# EAGLE design daisy (EAGLE 7.6.0)
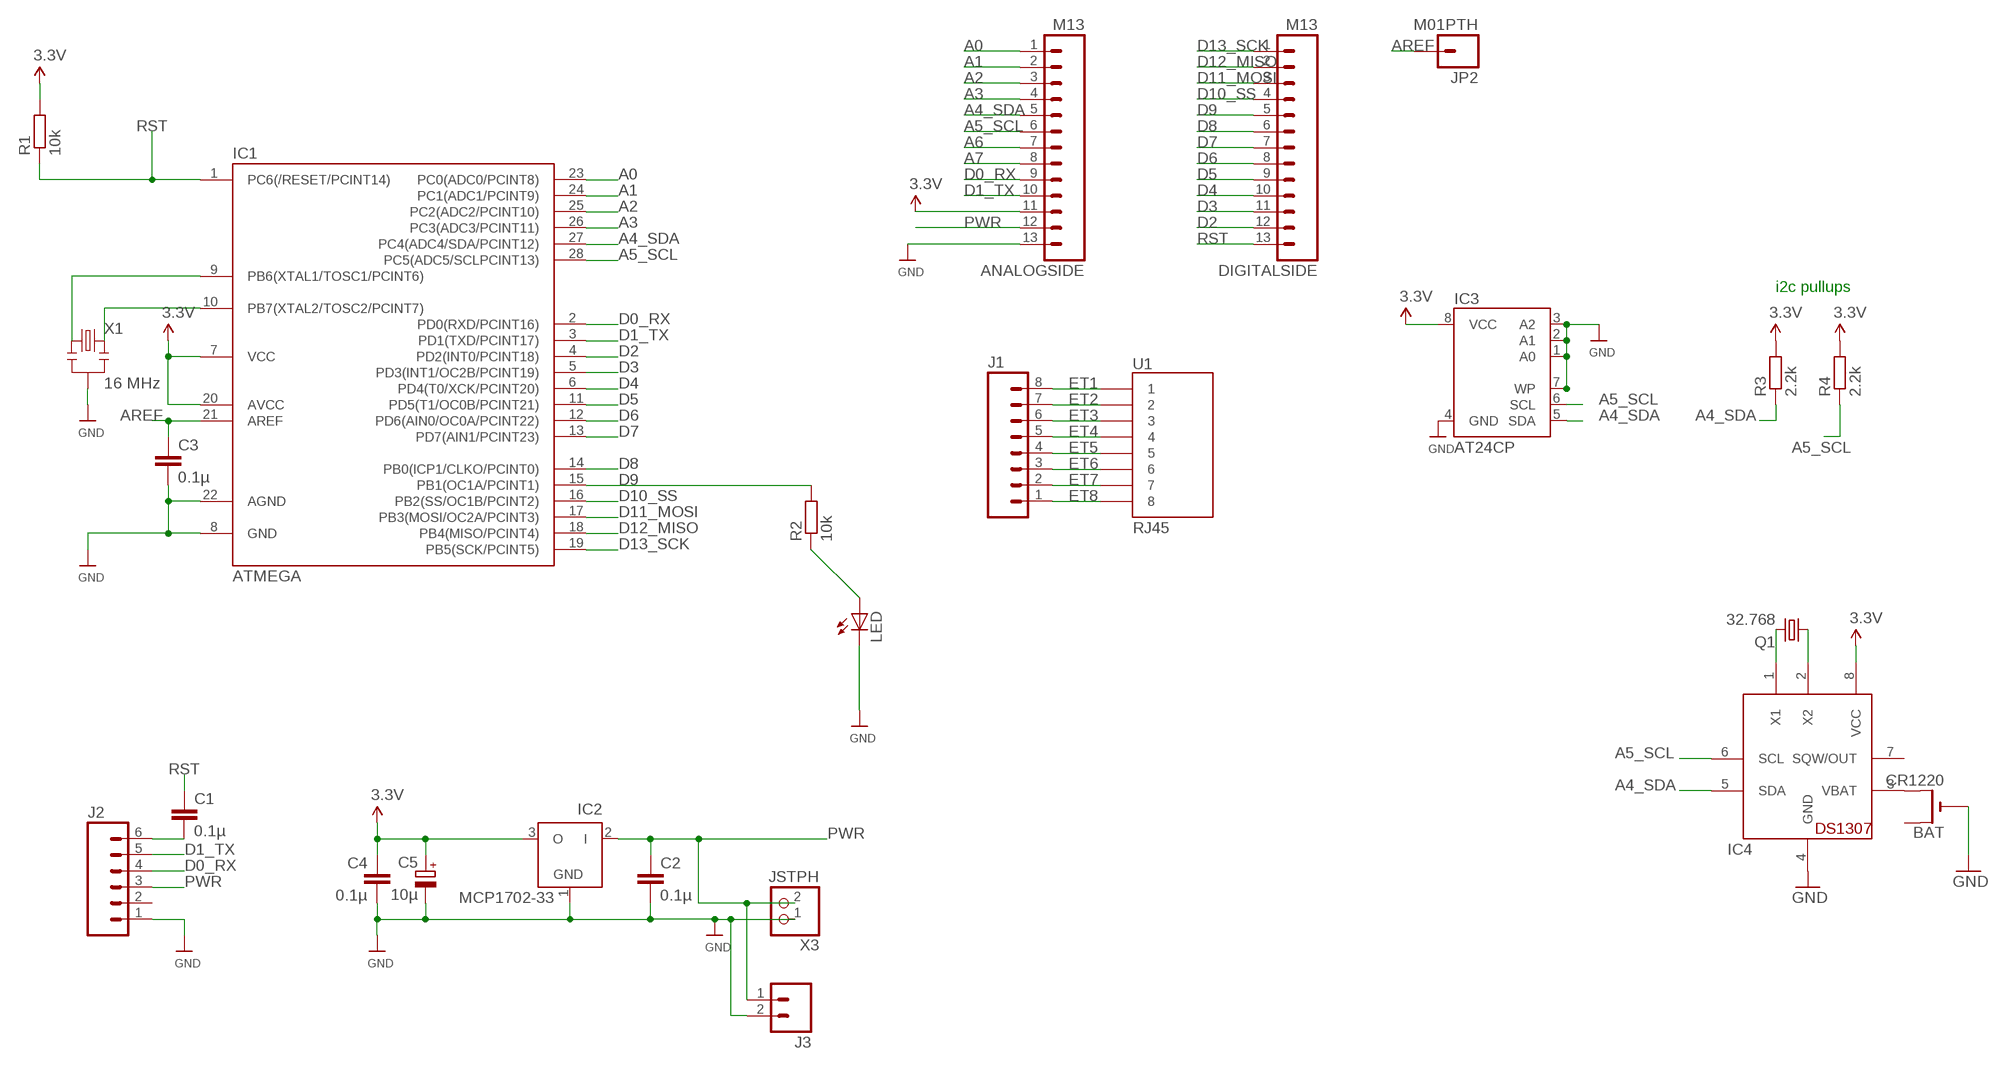
[diagram p0: schematic, sheet 1]

## Parts
ANALOGSIDE  M13  [1X13]
BAT  CR1220  CR1220THM  [CR1220-THM]
C1  0.1µ  C-EU025-024X044  [C025-024X044]
C2  0.1µ  C-EU025-024X044  [C025-024X044]
C3  0.1µ  C-EU025-024X044  [C025-024X044]
C4  0.1µ  C-EU025-024X044  [C025-024X044]
C5  10µ  CPOL-EUE1.8-4  [E1,8-4]
DIGITALSIDE  M13  [1X13]
IC1  ATMEGA  ATMEGA48/88/168-PU  [DIL28-3]
IC2  MCP1702-33  MCP1702Z  [TO92]
IC3  AT24CP  [DIL08]
IC4  DS1307  [DIL08]
J1  M08  [1X08_ROUND]
J2  M06SILK_FEMALE_PTH  [1X06]
J3  M02PTH  [1X02]
JP2  M01PTH  [1X01]
LED  LED3MM  [LED3MM]
Q1  32.768  CRYTALTC38H  [TC38H]
R1  10k  R-EU_0204/7  [0204/7]
R2  10k  R-EU_0204/7  [0204/7]
R3  2.2k  R-EU_0204/7  [0204/7]
R4  2.2k  R-EU_0204/7  [0204/7]
U1  RJ45  RJ45-8PTH  [RJ45-8]
X1  16 MHz  RESONATORPTH  [RESONATOR-PTH]
X3  JSTPH  CON_JST_PH_2PIN  [JSTPH2]

## Nets
A0: ANALOGSIDE.1 IC1.23(PC0(ADC0/PCINT8))
A1: ANALOGSIDE.2 IC1.24(PC1(ADC1/PCINT9))
A2: ANALOGSIDE.3 IC1.25(PC2(ADC2/PCINT10))
A3: ANALOGSIDE.4 IC1.26(PC3(ADC3/PCINT11))
A4_SDA: ANALOGSIDE.5 IC1.27(PC4(ADC4/SDA/PCINT12)) IC3.5(SDA) IC4.5(SDA) R3.1
A5_SCL: ANALOGSIDE.6 IC1.28(PC5(ADC5/SCLPCINT13)) IC3.6(SCL) IC4.6(SCL) R4.1
A6: ANALOGSIDE.7
A7: ANALOGSIDE.8
AREF: C3.1 IC1.21(AREF) JP2.1
D0_RX: ANALOGSIDE.9 IC1.2(PD0(RXD/PCINT16)) J2.4
D1_TX: ANALOGSIDE.10 IC1.3(PD1(TXD/PCINT17)) J2.5
D2: DIGITALSIDE.12 IC1.4(PD2(INT0/PCINT18))
D3: DIGITALSIDE.11 IC1.5(PD3(INT1/OC2B/PCINT19))
D4: DIGITALSIDE.10 IC1.6(PD4(T0/XCK/PCINT20))
D5: DIGITALSIDE.9 IC1.11(PD5(T1/OC0B/PCINT21))
D6: DIGITALSIDE.8 IC1.12(PD6(AIN0/OC0A/PCINT22))
D7: DIGITALSIDE.7 IC1.13(PD7(AIN1/PCINT23))
D8: DIGITALSIDE.6 IC1.14(PB0(ICP1/CLKO/PCINT0))
D9: DIGITALSIDE.5 IC1.15(PB1(OC1A/PCINT1)) R2.2
D10_SS: DIGITALSIDE.4 IC1.16(PB2(SS/OC1B/PCINT2))
D11_MOSI: DIGITALSIDE.3 IC1.17(PB3(MOSI/OC2A/PCINT3))
D12_MISO: DIGITALSIDE.2 IC1.18(PB4(MISO/PCINT4))
D13_SCK: DIGITALSIDE.1 IC1.19(PB5(SCK/PCINT5))
ET1: J1.8 U1.1
ET2: J1.7 U1.2
ET3: J1.6 U1.3
ET4: J1.5 U1.4
ET5: J1.4 U1.5
ET6: J1.3 U1.6
ET7: J1.2 U1.7
ET8: J1.1 U1.8
GND [power]: ANALOGSIDE.13 BAT.- C2.2 C3.2 C4.2 C5.- IC1.8(GND) IC1.22(AGND) IC2.1(GND) IC3.1(A0) IC3.2(A1) IC3.3(A2) IC3.4(GND) IC3.7(WP) IC4.4(GND) J2.1 J3.2 LED.K(C) X1.2 X3.1
N$1: IC1.9(PB6(XTAL1/TOSC1/PCINT6)) X1.1
N$2: LED.A R2.1
N$14: IC4.1(X1) Q1.2
N$15: IC4.2(X2) Q1.1
N$20: C1.2 J2.6
N$21: IC1.10(PB7(XTAL2/TOSC2/PCINT7)) X1.3
N$39: BAT.+2(+1) IC4.3(VBAT)
PWR [power]: ANALOGSIDE.12 C2.1 IC2.2(I) J2.3 J3.1 X3.2
RST: C1.1 DIGITALSIDE.13 IC1.1(PC6(/RESET/PCINT14)) R1.1
VCC [power]: ANALOGSIDE.11 C4.1 C5.+ IC1.7(VCC) IC1.20(AVCC) IC2.3(O) IC3.8(VCC) IC4.8(VCC) R1.2 R3.2 R4.2 ; supply symbol labelled 3.3V
Unconnected: BAT.+1(+) IC4.7(SQW/OUT) J2.2

## Notes on the sheet
- i2c pullups

## Library data of the parts
ANALOGSIDE DIGITALSIDE = SparkFun-Connectors:M13: 13-pin single row .1" header
BAT = adafruit:CR1220: CR1216/CR1220/CR1225 12mm 3V lithium coin cell Great for battery packup. Both SMT and THM holders. Note the THM package has the ground pads on both sides of the PCB so that the masks are the same - this reduces the cost
C1-C4 = resistor:C-EU: CAPACITOR, European symbol
C5 = resistor:CPOL-EU: POLARIZED CAPACITOR, European symbol
IC1 = atmega8:ATMEGA48/88/168-PU
IC2 = JeeLabs:MCP1702: 200 mA, Low Power Low Dropout Voltage Regulator
IC3 = atmel:AT24C*: 2-wire serial EEPROM; MPN: AT24C1024BW-SH-B; OC_FARNELL: 1362646; OC_NEWARK: 03P2044
IC4 = adafruit:DS1307: DS1307 Real time clock (RTC) with battery backup ability. Talk to it via i2c
J1 = SparkFun-Connectors:M08: Header 8 Standard 8-pin 0.1" header. Use with straight break away headers (SKU : PRT-00116), right angle break away headers (PRT-00553), swiss pins (PRT-00743), machine pins (PRT-00117), and female headers (PRT-00115).; PROD_ID: CONN-08437
J2 = SparkFun-Connectors:M06: Header 6 Standard 6-pin 0.1" header. Use with straight break away headers (SKU : PRT-00116), right angle break away headers (PRT-00553), swiss pins (PRT-00743), machine pins (PRT-00117), and female headers (PRT-00115). Molex polarized connector foot print use with SKU : PRT-08094 with associated crimp pins and housings. NOTES ON THE VARIANTS LOCK and LOCK_LONGPADS... This footprint was designed to help hold the alignment of a through-hole component (i.e. 6-pin header) while soldering it into place. You may notice that each hole has been shifted either up or down by 0.005 of an inch from it's more standard position (which is a perfectly straight line). This slight alteration caused the pins (the squares in the middle) to touch the edges of the holes. Because they are alternating, it causes a "brace" to hold the component in place. 0.005 has proven to be the perfect amount of "off-center" position when using our standard breakaway headers. Although looks a little odd when you look at the bare footprint, once you have a header in there, the alteration is very hard to notice. Also,if you push a header all the way into place, it is covered up entirely on the bottom side. This idea of altering the position of holes to aid alignment will be further integrated into the Sparkfun Library for other footprints. It can help hold any component with 3 or more connection pins.; PROD_ID: CONN-08437
J3 = SparkFun-Connectors:M02: Standard 2-pin 0.1" header. Use with - straight break away headers ( PRT-00116) - right angle break away headers (PRT-00553) - swiss pins (PRT-00743) - machine pins (PRT-00117) - female headers (PRT-00115) Molex polarized connector foot print use with: PRT-08233 with associated crimp pins and housings. 2.54_SCREWTERM for use with PRT-10571. 3.5mm Screw Terminal footprints for PRT-08084 5mm Screw Terminal footprints for use with PRT-08432
JP2 = SparkFun-Connectors:M01: Header 1 Standard 1-pin 0.1" header. Use with straight break away headers (SKU : PRT-00116), right angle break away headers (PRT-00553), swiss pins (PRT-00743), machine pins (PRT-00117), and female headers (PRT-00115).
LED = led:LED: LED OSRAM: - CHIPLED LG R971, LG N971, LY N971, LG Q971, LY Q971, LO R971, LY R971 LH N974, LH R974 LS Q976, LO Q976, LY Q976 LO Q996 - Hyper CHIPLED LW Q18S LB Q993, LB Q99A, LB R99A - SideLED LS A670, LO A670, LY A670, LG A670, LP A670 LB A673, LV A673, LT A673, LW A673 LH A674 LY A675 LS A676, LA A676, LO A676, LY A676, LW A676 LS A679, LY A679, LG A679 - Hyper Micro SIDELED® LS Y876, LA Y876, LO Y876, LY Y876 LT Y87S - SmartLED LW L88C, LW L88S LB L89C, LB L89S, LG L890 LS L89K, LO L89K, LY L89K LS L896, LA L896, LO L896, LY L896 - TOPLED LS T670, LO T670, LY T670, LG T670, LP T670 LSG T670, LSP T670, LSY T670, LOP T670, LYG T670 LG T671, LOG T671, LSG T671 LB T673, LV T673, LT T673, LW T673 LH T674 LS T676, LA T676, LO T676, LY T676, LB T676, LH T676, LSB T676, LW T676 LB T67C, LV T67C, LT T67C, LS T67K, LO T67K, LY T67K, LW E67C LS E67B, LA E67B, LO E67B, LY E67B, LB E67C, LV E67C, LT E67C LW T67C LS T679, LY T679, LG T679 LS T770, LO T770, LY T770, LG T770, LP T770 LB T773, LV T773, LT T773, LW T773 LH T774 LS E675, LA E675, LY E675, LS T675 LS T776, LA T776, LO T776, LY T776, LB T776 LHGB T686 LT T68C, LB T68C - Hyper Mini TOPLED® LB M676 - Mini TOPLED Santana® LG M470 LS M47K, LO M47K, LY M47K Source: http://www.osram.convergy.de LUXEON: - LUMILED® LXK2-PW12-R00, LXK2-PW12-S00, LXK2-PW14-U00, LXK2-PW14-V00 LXK2-PM12-R00, LXK2-PM12-S00, LXK2-PM14-U00 LXK2-PE12-Q00, LXK2-PE12-R00, LXK2-PE12-S00, LXK2-PE14-T00, LXK2-PE14-U00 LXK2-PB12-K00, LXK2-PB12-L00, LXK2-PB12-M00, LXK2-PB14-N00, LXK2-PB14-P00, LXK2-PB14-Q00 LXK2-PR12-L00, LXK2-PR12-M00, LXK2-PR14-Q00, LXK2-PR14-R00 LXK2-PD12-Q00, LXK2-PD12-R00, LXK2-PD12-S00 LXK2-PH12-R00, LXK2-PH12-S00 LXK2-PL12-P00, LXK2-PL12-Q00, LXK2-PL12-R00 Source: www.luxeon.com KINGBRIGHT: KA-3528ASYC Source: www.kingbright.com
Q1 = crystal:CRYTAL: CRYSTAL
R1-R4 = resistor:R-EU_: RESISTOR, European symbol
U1 = SparkFun:RJ45-8: RJ45 Jack Simple RJ45, 8-pin connection - connector for common Cat5, Cat5e, and Cat6 Ethernet cables. Footprint not yet proven in production. Connector sku is PRT-00643; Breakout PCB sku is BOB-00716.
X1 = SparkFun:RESONATOR: Resonator Small SMD resonator. This is the itty bitty 10/20MHz resonators with built in caps. CSTCE10M0G55 and CSTCE20M0V53. Footprint has been reviewed closely but hasn't been tested yet.
X3 = microbuilder:CON_JST_PH_2PIN: JST 2-Pin Right-Angle Connector PH-Series - 4UConnector: 17311 SH-Series - 4UConnector: 07278

## Net classes
1 power: width 0.381 mm, clearance 0.254 mm

## Board
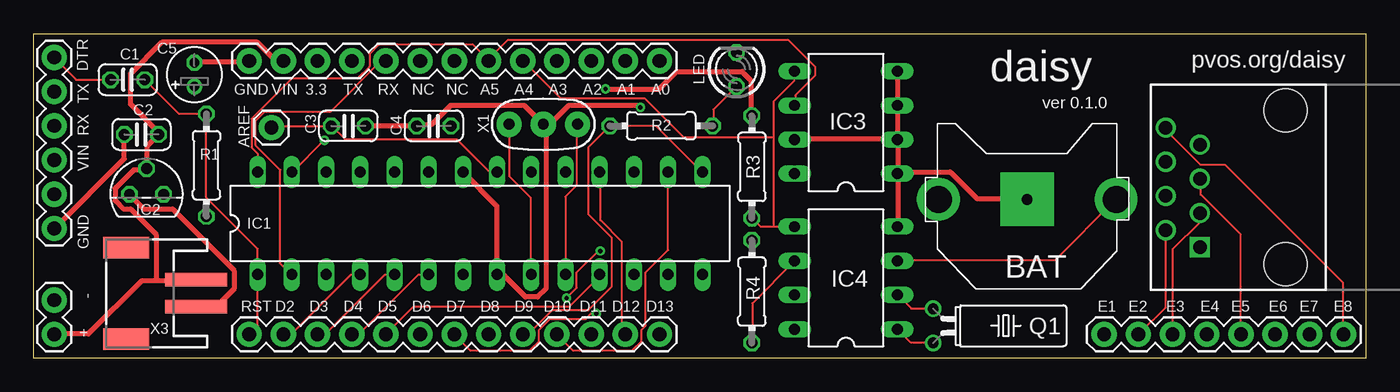
[diagram p1: board, top side]
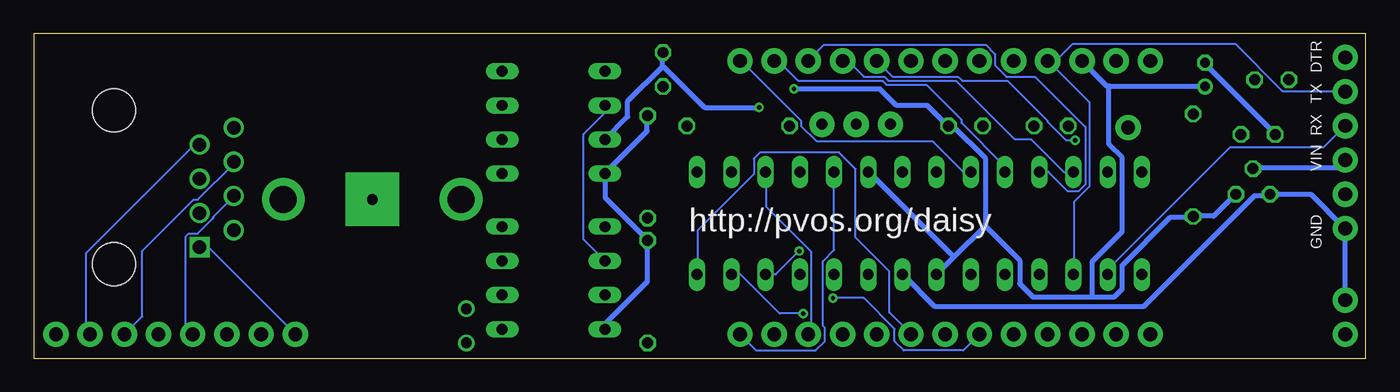
[diagram p2: board, bottom side, seen from below]

Size 98.93 x 24.13 mm. Coordinates in mm from the lower left corner, seen from the top.
Outline: 0,0 0,24.13 98.93,24.13 98.93,0 0,0
Copper layers (1*16): Top 0.0356mm / dielectric 1.5011mm / Bottom 0.0356mm
Design rules "LaenPCBOrder": minimum track width 6mil, minimum drill 13mil, track to track 6mil, track to pad 6mil, pad to pad 6mil, via to via 6mil, smd to smd 6mil, copper to edge 15mil, drill to drill 6mil, minimum pad ring 7mil, minimum via ring 7mil, stop-mask expansion 3mil, vias tented up to drill 0mil, thermal gap 10mil

### Footprints (pad centres in the part's own frame; a part is rotated, then mirrored left to right if it is on the bottom)
1X13 = drill 1.016 pad 1.88: 1 0,0; 2 2.54,0; 3 5.08,0; 4 7.62,0; 5 10.16,0; 6 12.7,0; 7 15.24,0; 8 17.78,0; 9 20.32,0; 10 22.86,0; 11 25.4,0; 12 27.94,0; 13 30.48,0
CR1220-THM = drill 2 pad 3.175: +1 -6.604,0; +2 6.604,0 | drill 0.8 pad 3.962 square: - 0,0
C025-024X044 = drill 0.813 octagon: 1 -1.27,0; 2 1.27,0
E1,8-4 = drill 0.711 pad 1.168: + -0.889,0 | drill 0.711 pad 1.168 octagon: - 0.889,0
DIL28-3 = drill 0.813 long: 1 -16.51,-3.81; 2 -13.97,-3.81; 3 -11.43,-3.81; 4 -8.89,-3.81; 5 -6.35,-3.81; 6 -3.81,-3.81; 7 -1.27,-3.81; 8 1.27,-3.81; 9 3.81,-3.81; 10 6.35,-3.81; 11 8.89,-3.81; 12 11.43,-3.81; 13 13.97,-3.81; 14 16.51,-3.81; 15 16.51,3.81; 16 13.97,3.81; 17 11.43,3.81; 18 8.89,3.81; 19 6.35,3.81; 20 3.81,3.81; 21 1.27,3.81; 22 -1.27,3.81; 23 -3.81,3.81; 24 -6.35,3.81; 25 -8.89,3.81; 26 -11.43,3.81; 27 -13.97,3.81; 28 -16.51,3.81
TO92 = drill 0.813 octagon: 1 -1.27,0; 2 0,1.905; 3 1.27,0
DIL08 = drill 0.813 long: 1 -3.81,-3.81; 2 -1.27,-3.81; 3 1.27,-3.81; 4 3.81,-3.81; 5 3.81,3.81; 6 1.27,3.81; 7 -1.27,3.81; 8 -3.81,3.81
1X08_ROUND = drill 1.016 pad 1.88: 1 0,0; 2 2.54,0; 3 5.08,0; 4 7.62,0; 5 10.16,0; 6 12.7,0; 7 15.24,0; 8 17.78,0
1X06 = drill 1.016 pad 1.88: 1 0,0; 2 2.54,0; 3 5.08,0; 4 7.62,0; 5 10.16,0; 6 12.7,0
1X02 = drill 1.016 pad 1.88: 1 0,0; 2 2.54,0
1X01 = drill 1.016 pad 1.88: 1 0,0
LED3MM = drill 0.813 octagon: A -1.27,0; K 1.27,0
TC38H = drill 0.813: 1 -1.27,0; 2 1.27,0
0204/7 = drill 0.813 octagon: 1 -3.81,0; 2 3.81,0
RJ45-8 = drill 1 square: 1 -4.445,6.35 | drill 1: 2 -3.175,8.89; 3 -1.905,6.35; 4 -0.635,8.89; 5 0.635,6.35; 6 1.905,8.89; 7 3.175,6.35; 8 4.445,8.89 | hole 3.2: -5.715,0; 5.715,0
RESONATOR-PTH = drill 0.8 pad 1.88: 1 -2.54,0; 2 0,0; 3 2.54,0
JSTPH2 = smd 1 x 4.6: 1 -1,-3.7; 2 1,-3.7 | smd 1.6 x 3.4: NC1 -3.4,1.5; NC2 3.4,1.5

### Placement (x,y rotation side)
ANALOGSIDE  46.48,22.1 180 top
BAT  73.79,11.81 0 top
C1  6.99,20.7 180 top
C2  8,16.64 180 top
C3  23.37,17.27 0 top
C4  29.72,17.27 180 top
C5  11.94,21.08 90 top
DIGITALSIDE  46.48,1.78 180 top
IC1  33.15,10.03 0 top
IC2  8.38,12.19 0 top
IC3  60.32,17.53 90 top
IC4  60.32,5.97 90 top
J1  97.28,1.78 180 top
J2  1.52,9.65 90 top
J3  1.52,1.78 90 top
JP2  17.65,17.14 0 top
LED  52.2,21.46 90 top
Q1  66.8,2.41 270 top
R1  12.83,14.35 270 top
R2  46.61,17.27 180 top
R3  53.34,14.22 90 top
R4  53.34,4.95 90 top
U1  92.96,12.7 90 top
X1  37.85,17.4 0 top
X3  8.38,4.83 90 top

### Tracks (layer width: path | path; a pad name or v marks a point on that pad's centre or on a via)
A0
  Bottom 0.152: IC1.23 29.9,13.84 32.18,16.13 40.79,16.13 41.93,17.27 41.93,17.65 46.43,22.15 ANALOGSIDE.1
A1
  Bottom 0.152: IC1.24 26.85,13.84 26.85,14.3 30.05,17.5 30.05,17.73 32.64,20.32 35.61,20.32 35.92,20.62 42.16,20.62 43.61,22.07 43.92,22.07 ANALOGSIDE.2
A2
  Bottom 0.152: IC1.25 23.57,13.84 22.12,12.39 21.36,12.39 20.83,12.93 20.83,17.2 24.56,20.93 26.7,20.93 27.53,21.77 27.53,22.61 28.22,23.29 40.26,23.29 41.4,22.15 ANALOGSIDE.3
A3
  Bottom 0.152: IC1.26 22.43,13.84 24.87,16.28 26.09,16.28 30.43,20.62 35.46,20.62 35.76,20.93 37.29,20.93 38.43,22.07 38.81,22.07 ANALOGSIDE.4
A4_SDA  (via drill 0.33)
  Top 0.152: 54.97,9.8 53.97,9.8 53.36,10.41 R3.1 | 54.97,9.8 56.49,9.8 IC4.5 | 54.97,9.8 54.97,16.43 | 54.97,16.43 54.97,19.1 56.49,20.62 56.49,21.31 IC3.5 | v21.59,16.2 19.23,13.84 IC1.27 | 54.97,16.43 48.26,16.43 45.36,19.33 39.12,19.33 36.37,22.07 ANALOGSIDE.5
  Bottom 0.152: v21.59,16.2 22.28,16.2 23.65,17.58 23.65,17.65 26.62,20.62 29.97,20.62 30.28,20.93 35.15,20.93 ANALOGSIDE.5
A5_SCL
  Top 0.152: IC4.6 53.36,4.09 53.36,1.19 R4.1 | IC1.28 16.64,15.21 16.18,15.67 16.18,17.8 19.15,20.78 24.03,20.78 24.94,21.69 24.94,22.61 25.63,23.29 32.64,23.29 33.78,22.15 ANALOGSIDE.6 33.78,22.22 35.23,23.67 56.03,23.67 58.01,21.69 58.01,21.01 56.57,19.56 56.57,18.8 IC3.6
  Bottom 0.152: IC4.6 58.09,8.81 58.09,16.66 56.57,18.19 56.57,18.8 IC3.6
AREF
  Top 0.152: JP2.1 17.78,17.27 C3.1 22.12,17.27 23.11,16.28 31.42,16.28 33.86,13.84 IC1.21
D0_RX
  Top 0.152: ANALOGSIDE.9 26.16,22.07 25.78,22.07 22.05,18.34 17.17,18.34 16.48,17.65 16.48,15.82 18.31,14 18.31,7.06 19.15,6.22 IC1.2
  Bottom 0.152: IC1.2 19.15,6.22 19.15,6.6 10.08,15.67 3.15,15.67 1.55,17.27 J2.4
D1_TX
  Bottom 0.152: IC1.3 21.67,6.22 21.67,11.63 20.52,12.78 20.52,19.02 23.57,22.07 ANALOGSIDE.10 23.27,21.84 21.74,23.37 9.7,23.37 6.2,19.86 1.55,19.86 J2.5
D2
  Top 0.152: IC1.4 23.57,6.22 19.15,1.8 18.54,1.8 DIGITALSIDE.12
D3
  Top 0.152: IC1.5 26.09,6.22 21.67,1.8 21.13,1.8 DIGITALSIDE.11
D4
  Top 0.152: IC1.6 28.6,6.22 24.18,1.8 23.65,1.8 DIGITALSIDE.10
D5
  Top 0.152: IC1.11 42.01,6.22 42.01,6.07 39.8,3.86 28.22,3.86 26.16,1.8 DIGITALSIDE.9
D6  (via drill 0.33)
  Top 0.152: v42.09,7.98 41.93,7.98 40.34,6.38 40.34,5.23 v39.57,4.47
  Bottom 0.152: IC1.12 43.84,6.22 v42.09,7.98 | v39.57,4.47 37.29,4.47 35,2.18 35,1.27 34.31,0.58 29.9,0.58 DIGITALSIDE.8
D7  (via drill 0.33)
  Top 0.152: v41.78,3.33 41.4,3.33 41.02,2.95 38.35,2.95 37.52,2.11 37.52,1.27 36.83,0.58 32.41,0.58 31.27,1.73 DIGITALSIDE.7
  Bottom 0.152: IC1.13 46.43,6.22 43.54,3.33 v41.78,3.33
D8
  Bottom 0.152: IC1.14 49.63,6.22 49.63,9.5 45.44,13.69 45.44,14.83 44.98,15.29 39.12,15.29 37.9,14.07 37.9,8.97 35.38,6.45 35.38,3.4 33.78,1.8 DIGITALSIDE.6
D9
  Top 0.152: IC1.15 49.63,13.84 46.2,17.27 R2.2 42.77,17.27 41.17,15.67 41.17,10.72 42.93,8.97 42.93,5.31 41.17,3.56 38.51,3.56 36.75,1.8 36.37,1.8 DIGITALSIDE.5
D10_SS
  Top 0.152: IC1.16 47.12,8.05 45.44,6.38 45.44,2.41 45.14,2.11 45.14,1.27 44.45,0.58 40.03,0.58 38.89,1.73 DIGITALSIDE.4
D11_MOSI
  Bottom 0.152: IC1.17 44.53,13.84 44.53,11.25 41.17,7.9 41.17,2.03 41.4,1.8 DIGITALSIDE.3
D12_MISO
  Top 0.152: DIGITALSIDE.2 43.69,2.03 43.69,8.66 42.09,10.26 42.09,13.84 IC1.18
D13_SCK
  Bottom 0.152: IC1.19 39.5,8.05 40.34,7.21 40.34,2.41 40.18,2.26 40.18,1.27 40.87,0.58 45.29,0.58 DIGITALSIDE.1
ET1
  Bottom 0.152: U1.1 86.59,8.2 85.9,8.2 79.5,1.8 J1.8
ET2
  Top 0.152: U1.2 84.07,3.79 82.09,1.8 J1.7
ET3
  Top 0.152: U1.3 86.59,10.8 86.59,10.11 84.61,8.13 84.61,1.8 J1.6
ET4
  Bottom 0.152: U1.4 84.07,12.01 85.6,10.49 85.6,10.41 86.74,9.27 87.43,9.27 87.66,9.04 87.66,2.34 87.12,1.8 J1.5
ET5
  Top 0.152: U1.5 86.67,13.31 86.67,12.17 89.64,9.2 89.64,1.8 J1.4
ET6
  Bottom 0.152: U1.6 84.07,14.45 86.74,11.79 87.05,11.79 90.86,7.98 90.86,3.1 92.15,1.8 J1.3
ET7
  Bottom 0.152: U1.7 86.67,15.82 87.05,15.82 95.05,7.82 95.05,2.11 94.74,1.8 J1.2
ET8
  Top 0.152: U1.8 84.07,16.97 86.67,14.38 88.49,14.38 97.26,5.61 97.26,1.8 J1.1
GND  (via drill 0.33)
  Top 0.381: C5.- 11.99,22 15.88,22 15.95,22.07 ANALOGSIDE.13 | X3.1 12.14,3.86 13.59,3.86 14.88,5.16 14.88,6.53 10.31,11.1 8.18,11.1 7.11,12.17 IC2.1 | C2.2 6.73,14.83 1.55,9.65 J2.1 | IC1.22 34.39,11.33 34.39,6.22 IC1.8 34.54,6.15 34.92,6.15 36.52,4.55 37.44,4.55 38.05,5.16 38.05,17.2 X1.2 | C3.2 C4.2 28.6,17.35 29.52,17.35 30.96,18.8 36.45,18.8 X1.2 | IC4.4 64.19,9.8 64.19,13.69 IC3.1 | IC3.7 56.57,16.28 64.11,16.28 IC3.2 | IC3.2 64.19,16.43 64.19,18.8 IC3.3 64.19,18.95 64.19,21.31 IC3.4 | IC3.1 64.19,13.84 64.19,16.13 IC3.2 | BAT.- 73.79,11.86 70.05,11.86 68.07,13.84 64.34,13.84 IC3.1 | v45.06,18.64 44.91,18.8 39.73,18.8 38.2,17.27 X1.2
  Bottom 0.381: C2.2 6.73,16.66 11.99,21.92 C5.- | J3.2 1.55,4.32 1.55,9.5 J2.1 1.55,9.65 4.06,12.17 7.11,12.17 IC2.1 7.26,12.09 8.25,12.09 16.48,3.86 32.03,3.86 34.39,6.22 IC1.8 | 52.22,21.69 52.22,22.68 LED.K | 52.22,21.69 54.81,19.1 54.81,17.96 IC3.7 | v45.06,18.64 49.1,18.64 52.07,21.61 52.22,21.69
N$1
  Top 0.152: X1.1 35.31,13.54 36.91,11.94 36.91,6.22 IC1.9
N$2
  Top 0.152: R2.1 50.47,17.27 50.47,18.49 52.15,20.17 LED.A
N$14
  Top 0.152: IC4.1 65.1,1.19 66.78,1.19 Q1.2
N$15
  Top 0.152: Q1.1 66.78,3.71 65.18,3.71 64.19,4.7 IC4.2
N$20
  Top 0.152: C1.2 3.15,20.7 1.55,22.3 J2.6
N$21
  Top 0.152: IC1.10 39.5,12.01 40.34,12.85 40.34,17.35 X1.3
N$39
  Top 0.152: IC4.3 64.19,7.29 75.84,7.29 80.34,11.79 BAT.+2
PWR
  Top 0.381: 9.09,5.77 12.07,5.77 X3.2 | 9.09,5.77 8.03,5.77 4.06,1.8 1.55,1.8 J3.1 | ANALOGSIDE.12 18.54,22.15 17.93,22.15 16.56,23.52 9.55,23.52 7.19,21.16 7.19,18.87 9.25,16.81 C2.1 9.25,16.59 8.41,15.75 8.41,14.15 IC2.2 8.25,14 7.42,14 6.04,12.62 6.04,11.71 6.66,11.1 7.19,11.1 9.09,9.2 9.09,5.77
  Bottom 0.381: IC2.2 8.33,14.15 2.08,14.15 1.55,14.68 J2.3
RST
  Top 0.152: C1.1 10.77,18.19 12.83,18.19 R1.1 12.83,11.94 16.64,8.13 IC1.1 16.64,2.41 DIGITALSIDE.13
VCC  (via drill 0.33)
  Top 0.381: v42.47,20.02 46.43,20.02 47.73,21.31 52.6,21.31 53.29,20.62 53.29,18.03 R3.2
  Bottom 0.381: IC4.8 56.49,2.18 56.49,2.56 53.36,5.69 53.36,8.59 R4.2 53.36,8.81 56.49,11.94 56.49,13.69 IC3.8 56.41,13.84 53.36,16.89 53.36,18.03 R3.2 | 19.07,20.24 19.23,20.24 ANALOGSIDE.11 | 19.07,20.24 11.99,20.24 C5.+ | IC2.3 9.7,12.17 11.3,10.57 12.83,10.57 R1.2 12.98,10.49 14.5,10.49 18.09,6.91 18.09,5.16 18.69,4.55 20.3,4.55 | 28.22,9.88 28.22,14.83 30.66,17.27 C4.1 31.12,17.35 32.56,18.8 34.85,18.8 36.07,20.02 v42.47,20.02 | IC1.7 30.58,7.52 | 30.58,7.52 28.22,9.88 | 30.58,7.52 36.91,13.84 IC1.20 | 20.3,4.55 24.71,4.55 25.71,5.54 25.71,7.29 28.14,9.73 28.22,9.88 | 19.07,20.24 19.07,15.9 18.09,14.91 18.09,9.42 20.3,7.21 20.3,4.55

### Text on the board
tPlace: daisy | pvos.org/daisy | ver 0.1.0
bPlace: http://pvos.org/daisy
tNames: C1 | C5 | LED | DTR | TX | GND | VIN | 3.3 | TX | RX | NC | NC | A5 | A4 | A3 | A2 | A1 | A0 | RX | C2 | AREF | C3 | C4 | X1 | R2 | VIN | R1 | IC2 | GND | IC1 | - | RST | D2 | D3 | D4 | D5 | D6 | D7 | D8 | D9 | D10 | D11 | D12 | D13 | E1 | E2 | E3 | E4 | E5 | E6 | E7 | E8 | + | X3
bNames: DTR | TX | RX | VIN | GND